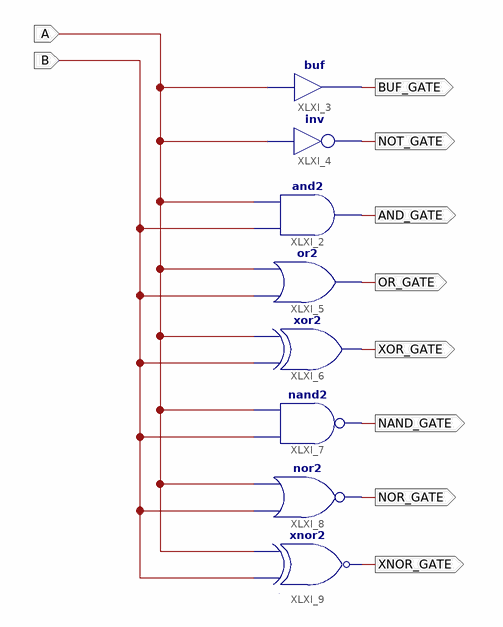
[diagram p0: schematic sheet 1]
// Xilinx ISE schematic Logic.sch (zynq) as structural Verilog: 8 symbols, 10 ports
module Logic (
  input  A,
  input  B,
  output BUF_GATE,
  output NOT_GATE,
  output AND_GATE,
  output OR_GATE,
  output XOR_GATE,
  output NAND_GATE,
  output NOR_GATE,
  output XNOR_GATE
);

  not XLXI_4 (NOT_GATE, A);
  buf XLXI_3 (BUF_GATE, A);
  and XLXI_2 (AND_GATE, B, A);
  or XLXI_5 (OR_GATE, B, A);
  xor XLXI_6 (XOR_GATE, B, A);
  nand XLXI_7 (NAND_GATE, B, A);
  xnor XLXI_9 (XNOR_GATE, B, A);
  nor XLXI_8 (NOR_GATE, B, A);
endmodule
